# EAGLE design v3 (EAGLE 9.0.1)
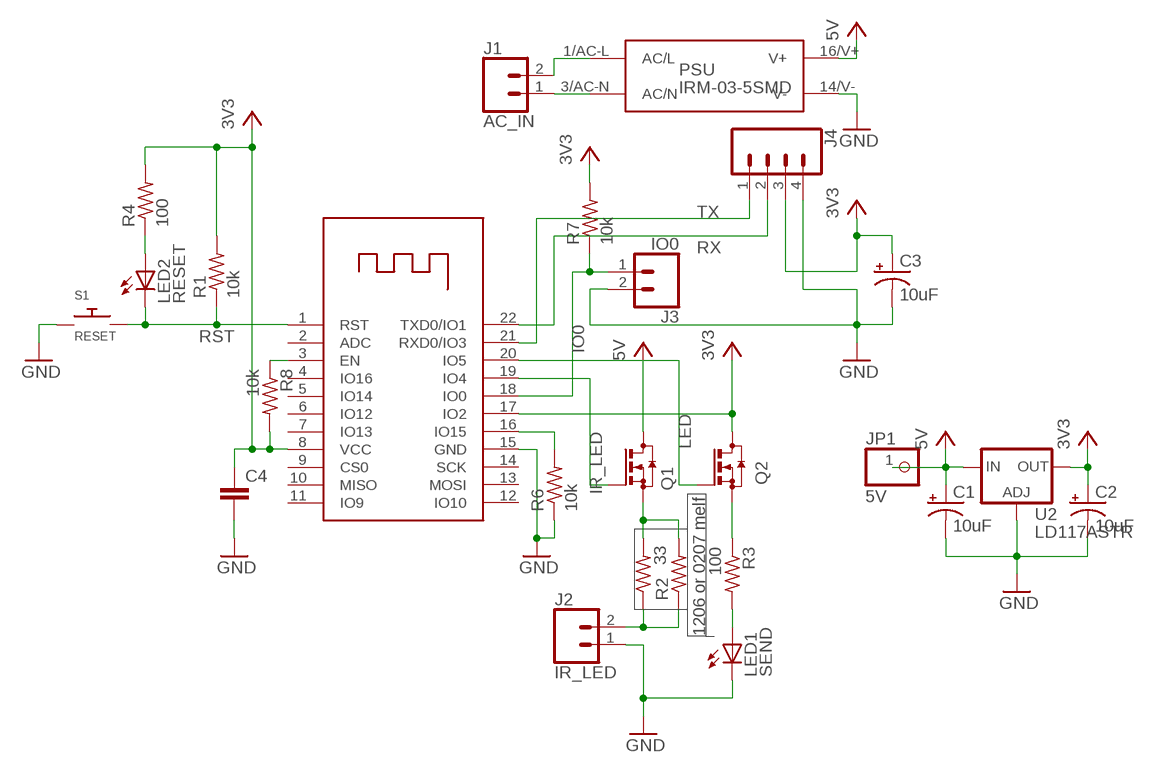
[diagram p0: schematic, sheet 1]

## Parts
C1  10uF  CPOL-US153CLV-0405  [153CLV-0405]
C2  10uF  CPOL-US153CLV-0405  [153CLV-0405]
C3  10uF  CPOL-US153CLV-0405  [153CLV-0405]
C4  C-EUC0805  [C0805]
J1  AC_IN  1X2_5MM_SCREW  [1X2_5MM_SCREW]
J2  IR_LED  1X2_5MM_SCREW  [1X2_5MM_SCREW]
J3  IO0  CONN_02  [1X02]
J4  CONN_04  [1X04]
JP1  5V  PINHD-1X1  [1X01]
LED1  SEND  LEDSML0805  [SML0805]
LED2  RESET  LEDSML0805  [SML0805]
PSU  IRM-03-5SMD  [IRM-03-5S]
Q1  N-MOSFET-SOT23  [SOT23]
Q2  N-MOSFET-SOT23  [SOT23]
R1  10k  R-US_R0603  [R0603]
R2  33  R-US_MELF0207R  [MINI_MELF-0207R]
R3  100  R-US_R0805  [R0805]
R4  100  R-US_R0805  [R0805]
R5  33  R-US_R1206  [R1206]
R6  10k  R-US_R0603  [R0603]
R7  10k  R-US_R0603  [R0603]
R8  10k  R-US_R0603  [R0603]
S1  RESET  BUTTON  [B3F-1000]
U1  ESP-12F  [ESP-12F]
U2  LD117ASTR  [SOT223]

## Nets
3V3: C2.+ C3.+ C4.1 J4.3 Q2.3(D) R1.2 R4.2 R7.2 R8.2 U1.8(VCC) U1.17(IO2) U2.4(OUT)
5V: C1.+ JP1.1 PSU.16/V+(V+) Q1.3(D) U2.3(IN)
AC/L: J1.2 PSU.1/AC-L(AC/L)
AC/N: J1.1 PSU.3/AC-N(AC/N)
EN: R8.1 U1.3(EN)
GND: C1.- C2.- C3.- C4.2 J2.1 J3.2 J4.4 LED1.C PSU.14/V-(V-) R6.1 S1.1 S1.2 U1.15(GND) U2.1(ADJ)
IO0: J3.1 R7.1 U1.18(IO0)
IR_LED: Q1.1(G) U1.19(IO4)
LED: Q2.1(G) U1.20(IO5)
N$1: LED2.A R4.1
N$2: LED1.A R3.2
N$3: R6.2 U1.16(IO15)
N$4: Q2.2(S) R3.1
N$5: Q1.2(S) R2.2 R5.2
N$6: J2.2 R2.1 R5.1
RST: LED2.C R1.1 S1.3 S1.4 U1.1(RST)
RX: J4.2 U1.22(TXD0/IO1)
TX: J4.1 U1.21(RXD0/IO3)
Unconnected: U1.2(ADC) U1.4(IO16) U1.5(IO14) U1.6(IO12) U1.7(IO13) U1.9(CS0) U1.10(MISO) U1.11(IO9) U1.12(IO10) U1.13(MOSI) U1.14(SCK)

## Notes on the sheet
- 1206 or 0207 melf

## Library data of the parts
C1-C3 = resistor:CPOL-US: POLARIZED CAPACITOR, American symbol
C4 = resistor:C-EU: CAPACITOR, European symbol
J1 J2 = my_parts:1X2_5MM_SCREW
J3 = SparkFun-Connectors:CONN_02: Multi connection point. Often used as Generic Header-pin footprint for 0.1 inch spaced/style header connections On any of the 0.1 inch spaced packages, you can populate with these: Break Away Headers - Straight <https://www.sparkfun.com/products/116> (PRT-00116) Break Away Male Headers - Right Angle <https://www.sparkfun.com/products/553> (PRT-00553) Female Headers <https://www.sparkfun.com/products/115> (PRT-00115) Break Away Headers - Machine Pin <https://www.sparkfun.com/products/117> (PRT-00117) Break Away Female Headers - Swiss Machine Pin <https://www.sparkfun.com/products/743> (PRT-00743) For SCREWTERMINALS and SPRING TERMINALS visit here: Screw Terimnals on SparkFun.com <https://www.sparkfun.com/search/results?term=Screw+Terminals> (5mm/3.5mm/2.54mm spacing) This device is also useful as a general connection point to wire up your design to another part of your project. Our various solder wires solder well into these plated through hole pads. Hook-Up Wire - Assortment (Stranded, 22 AWG) <https://www.sparkfun.com/products/11375> (PRT-11375) Hook-Up Wire - Assortment (Solid Core, 22 AWG) <https://www.sparkfun.com/products/11367> (PRT-11367) View the entire wire category on our website here <https://www.sparkfun.com/categories/141> Special notes: Molex polarized connector foot print use with: PRT-08233 with associated crimp pins and housings. 2.54_SCREWTERM for use with PRT-10571. 3.5mm Screw Terminal footprints for PRT-08084 5mm Screw Terminal footprints for use with PRT-08432
J4 = SparkFun-Connectors:CONN_04: Multi connection point. Often used as Generic Header-pin footprint for 0.1 inch spaced/style header connections On any of the 0.1 inch spaced packages, you can populate with these: Break Away Headers - Straight <https://www.sparkfun.com/products/116> (PRT-00116) Break Away Male Headers - Right Angle <https://www.sparkfun.com/products/553> (PRT-00553) Female Headers <https://www.sparkfun.com/products/115> (PRT-00115) Break Away Headers - Machine Pin <https://www.sparkfun.com/products/117> (PRT-00117) Break Away Female Headers - Swiss Machine Pin <https://www.sparkfun.com/products/743> (PRT-00743) For SCREWTERMINALS and SPRING TERMINALS visit here: Screw Terimnals on SparkFun.com <https://www.sparkfun.com/search/results?term=Screw+Terminals> (5mm/3.5mm/2.54mm spacing) This device is also useful as a general connection point to wire up your design to another part of your project. Our various solder wires solder well into these plated through hole pads. Hook-Up Wire - Assortment (Stranded, 22 AWG) <https://www.sparkfun.com/products/11375> (PRT-11375) Hook-Up Wire - Assortment (Solid Core, 22 AWG) <https://www.sparkfun.com/products/11367> (PRT-11367) View the entire wire category on our website here <https://www.sparkfun.com/categories/141> Special notes: Molex polarized connector foot print use with SKU : PRT-08231 with associated crimp pins and housings. 1MM SMD Version SKU: PRT-10208; PROD_ID: CONN-09696
JP1 = adafruit:PINHD-1X1: Pin header 1x1 for 0.1" spacing With round pins
LED1 LED2 = led:LED: LED OSRAM: - CHIPLED LG R971, LG N971, LY N971, LG Q971, LY Q971, LO R971, LY R971 LH N974, LH R974 LS Q976, LO Q976, LY Q976 LO Q996 - Hyper CHIPLED LW Q18S LB Q993, LB Q99A, LB R99A - SideLED LS A670, LO A670, LY A670, LG A670, LP A670 LB A673, LV A673, LT A673, LW A673 LH A674 LY A675 LS A676, LA A676, LO A676, LY A676, LW A676 LS A679, LY A679, LG A679 - Hyper Micro SIDELED® LS Y876, LA Y876, LO Y876, LY Y876 LT Y87S - SmartLED LW L88C, LW L88S LB L89C, LB L89S, LG L890 LS L89K, LO L89K, LY L89K LS L896, LA L896, LO L896, LY L896 - TOPLED LS T670, LO T670, LY T670, LG T670, LP T670 LSG T670, LSP T670, LSY T670, LOP T670, LYG T670 LG T671, LOG T671, LSG T671 LB T673, LV T673, LT T673, LW T673 LH T674 LS T676, LA T676, LO T676, LY T676, LB T676, LH T676, LSB T676, LW T676 LB T67C, LV T67C, LT T67C, LS T67K, LO T67K, LY T67K, LW E67C LS E67B, LA E67B, LO E67B, LY E67B, LB E67C, LV E67C, LT E67C LW T67C LS T679, LY T679, LG T679 LS T770, LO T770, LY T770, LG T770, LP T770 LB T773, LV T773, LT T773, LW T773 LH T774 LS E675, LA E675, LY E675, LS T675 LS T776, LA T776, LO T776, LY T776, LB T776 LHGB T686 LT T68C, LB T68C - Hyper Mini TOPLED® LB M676 - Mini TOPLED Santana® LG M470 LS M47K, LO M47K, LY M47K Source: http://www.osram.convergy.de LUXEON: - LUMILED® LXK2-PW12-R00, LXK2-PW12-S00, LXK2-PW14-U00, LXK2-PW14-V00 LXK2-PM12-R00, LXK2-PM12-S00, LXK2-PM14-U00 LXK2-PE12-Q00, LXK2-PE12-R00, LXK2-PE12-S00, LXK2-PE14-T00, LXK2-PE14-U00 LXK2-PB12-K00, LXK2-PB12-L00, LXK2-PB12-M00, LXK2-PB14-N00, LXK2-PB14-P00, LXK2-PB14-Q00 LXK2-PR12-L00, LXK2-PR12-M00, LXK2-PR14-Q00, LXK2-PR14-R00 LXK2-PD12-Q00, LXK2-PD12-R00, LXK2-PD12-S00 LXK2-PH12-R00, LXK2-PH12-S00 LXK2-PL12-P00, LXK2-PL12-Q00, LXK2-PL12-R00 Source: www.luxeon.com KINGBRIGHT: KA-3528ASYC Source: www.kingbright.com
PSU = my_parts:IRM-03-5
Q1 Q2 = my_parts:N-MOSFET
R1-R8 = resistor:R-US_: RESISTOR, American symbol
S1 = my_parts:BUTTON
U1 = my_parts:ESP-12F
U2 = v-reg:LD117A?*: Low drop fixed and adjustable positive voltage regulators 1 A Source: http://www.st.com/stonline/products/literature/ds/7194/ld1117axx.pdf

## Board
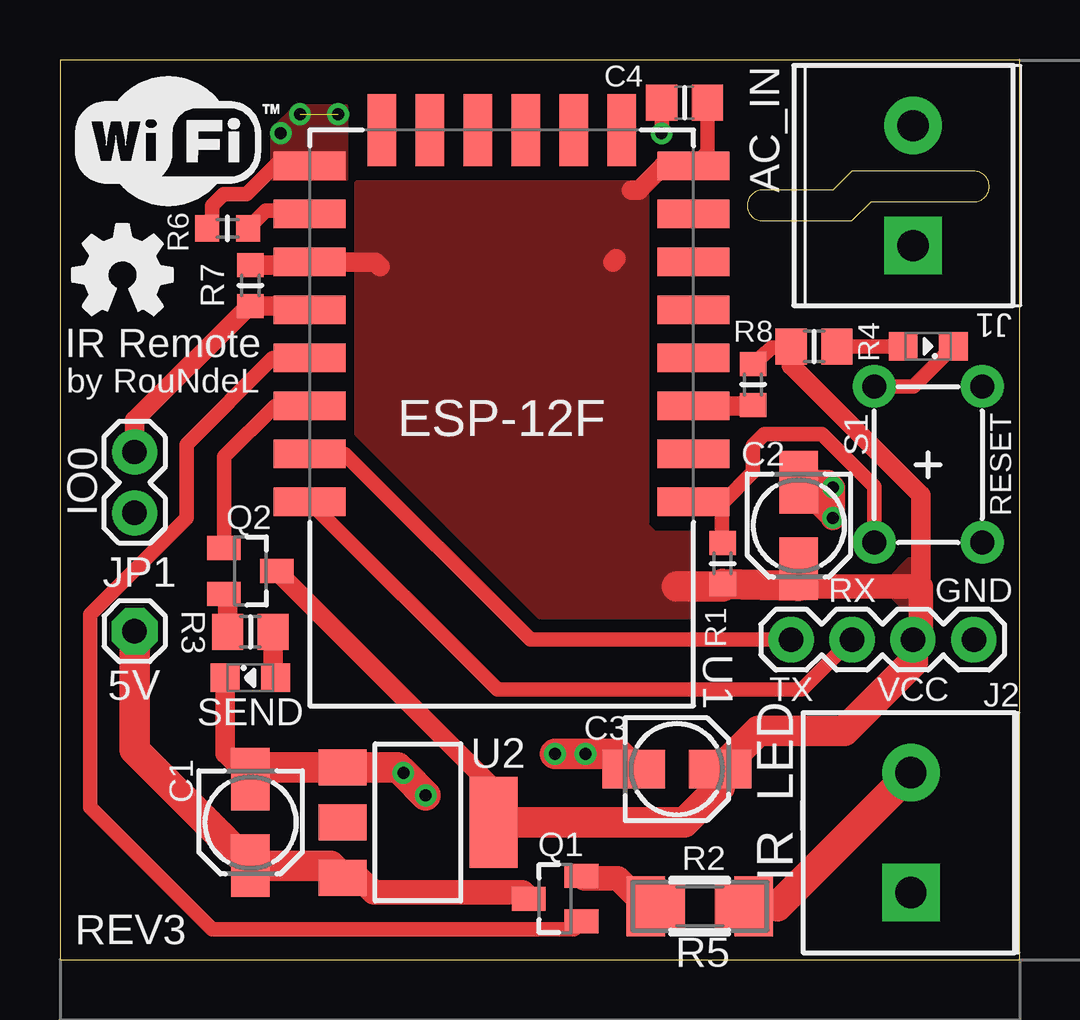
[diagram p1: board, top side]
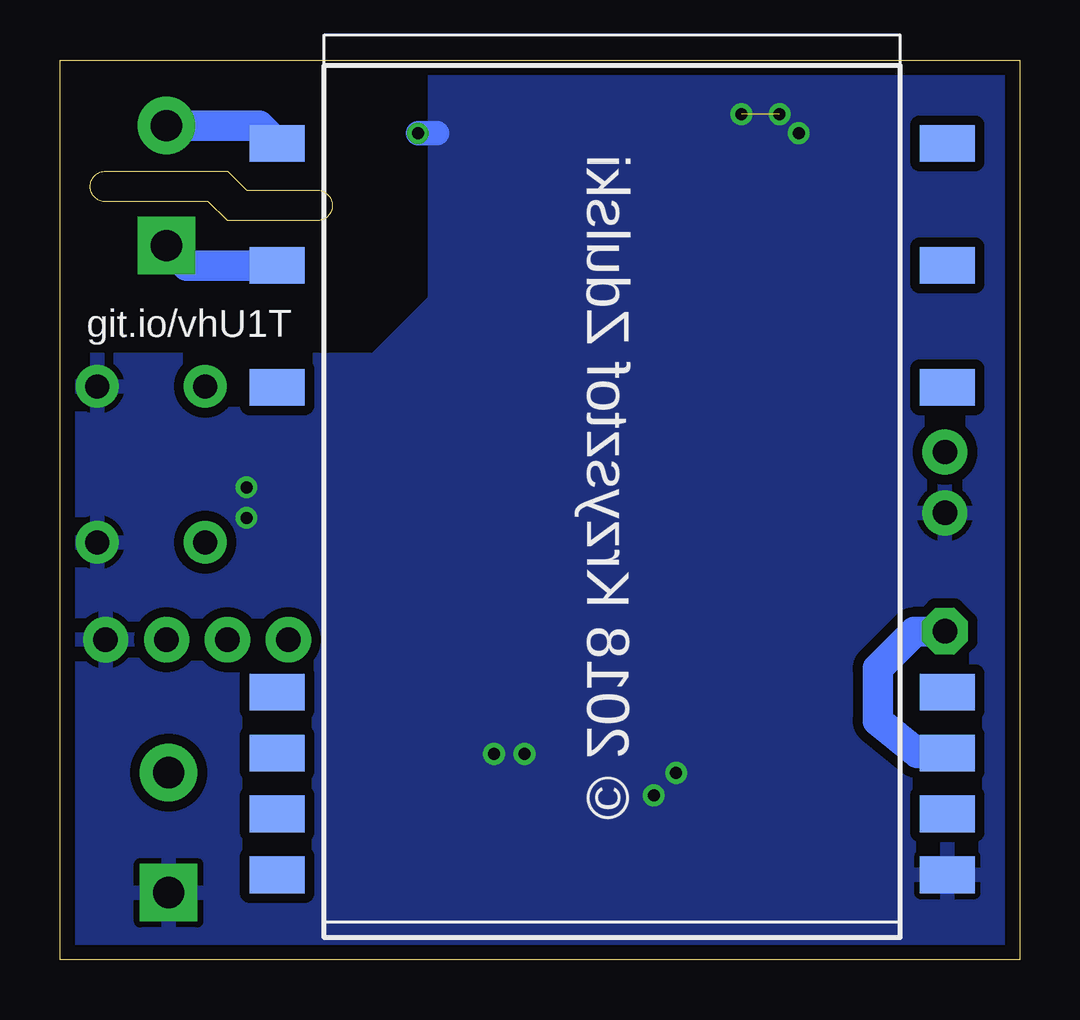
[diagram p2: board, bottom side, seen from below]

Size 40 x 37.5 mm. Coordinates in mm from the lower left corner, seen from the top.
Outline: 0,0 40,0 40,37.5 0,37.5 0,0
Outline: 38.1,32.86 33.02,32.86 32.23,32.07 29.37,32.07 arc194 29.37,30.8 33.02,30.8 33.81,31.59 38.1,31.59 arc181 38.1,32.86
Copper layers (1*16): Top 0.035mm / dielectric 1.5mm / Bottom 0.035mm
Design rules "default *": minimum track width 16mil, minimum drill 0.35mm, track to track 12mil, track to pad 12mil, pad to pad 12mil, via to via 12mil, smd to smd 6mil, copper to edge 24mil, drill to drill 0.6mm, minimum pad ring 10mil, minimum via ring 8mil, stop-mask expansion 4mil, vias tented up to drill 0.5mm, thermal gap 10mil

### Footprints (pad centres in the part's own frame; a part is rotated, then mirrored left to right if it is on the bottom)
153CLV-0405 = smd 2.6 x 1.6: + 1.8,0; - -1.8,0
C0805 = smd 1.3 x 1.5: 1 -0.95,0; 2 0.95,0
1X2_5MM_SCREW = drill 1.3 pad 2.4 square: 1 2.5,0 | drill 1.3 pad 2.4: 2 -2.5,0
1X02 = drill 1.016 pad 1.88: 1 0,0; 2 2.54,0
1X04 = drill 1.016 pad 1.88: 1 0,0; 2 2.54,0; 3 5.08,0; 4 7.62,0
1X01 = drill 1.016 pad 1.93 octagon: 1 0,0
SML0805 = smd 1.2 x 1.2: A 1.05,0; C -1.05,0
IRM-03-5S = smd 1.524 x 2.286: 1/AC-L -13.97,-13.97; 3/AC-N -8.89,-13.97; 5 -3.81,-13.97; 10 8.89,-13.97; 11 11.43,-13.97; 12 13.97,-13.97; 13 16.51,-13.97; 14/V- 16.51,13.97; 15 13.97,13.97; 16/V+ 11.43,13.97; 17 8.89,13.97; 22 -3.81,13.97; 24 -8.89,13.97; 26 -13.97,13.97
SOT23 = smd 1 x 1.4: 1 -0.95,-1.1; 2 0.95,-1.1; 3 0,1.1
R0603 = smd 1 x 1.1: 1 -0.85,0; 2 0.85,0
MINI_MELF-0207R = smd 1.6 x 2.5: 1 -2.25,0; 2 2.25,0
R0805 = smd 1.3 x 1.5: 1 -0.95,0; 2 0.95,0
R1206 = smd 1.6 x 1.803: 1 -1.422,0; 2 1.422,0
B3F-1000 = drill 1 pad 1.778: 1 -3.25,2.25; 2 3.25,2.25; 3 -3.25,-2.25; 4 3.25,-2.25
ESP-12F = smd 3 x 1.2: 1 -8,3.5; 2 -8,1.5; 3 -8,-0.5; 4 -8,-2.5; 5 -8,-4.5; 6 -8,-6.5; 7 -8,-8.5; 8 -8,-10.5; 15 8,-10.5; 16 8,-8.5; 17 8,-6.5; 18 8,-4.5; 19 8,-2.5; 20 8,-0.5; 21 8,1.5; 22 8,3.5 | smd 1.2 x 3: 9 -5,-12; 10 -3,-12; 11 -1,-12; 12 1,-12; 13 3,-12; 14 5,-12
SOT223 = smd 1.5 x 2: 1 -2.3,-3.15; 2 0,-3.15; 3 2.3,-3.15 | smd 3.8 x 2: 4 0,3.15

### Placement (x,y rotation side)
C1  7.94,5.71 270 top
C2  30.8,18.1 270 top
C3  25.72,7.94 0 top
C4  26.04,35.72 180 top
J1  35.56,32.27 270 top
J2  35.47,5.29 270 top
J3  3.11,21.16 270 top
J4  30.48,13.34 0 top
JP1  3.11,13.69 0 top
LED1  7.94,11.75 0 top
LED2  36.2,25.56 180 top
PSU  16.98,20.04 270 bottom
Q1  20.64,2.54 90 top
Q2  7.94,16.2 270 top
R1  27.62,16.52 270 top
R2  26.67,2.22 180 top
R3  7.94,13.66 0 top
R4  31.43,25.56 180 top
R5  26.67,2.22 180 top
R6  6.99,30.48 0 top
R7  7.94,28.1 90 top
R8  28.89,23.97 90 top
S1  36.2,20.64 270 top
U1  18.41,22.58 180 top
U2  14.92,5.71 270 top

### Tracks (layer width: path | path; a pad name or v marks a point on that pad's centre or on a via)
3V3
  Top 0.61: R4.2 30.17,25.51 29.68,25.52 R8.2 | U1.8 26.98,33.65 C4.1
  Top 0.813: Q2.3 18.07,7.16 U2.4 | U1.8 25.14,33.08 24.13,32.07 23.81,32.07 | 23.05,29.08 23.18,29.21 | 13.34,28.89 13.14,29.08 U1.17 10.28,28.95 R7.2 | 35.88,15.56 35.88,19.37 30.49,24.76 R4.2
  Top 1.016: R1.2 27.61,15.56 | J4.3 35.88,13.65 35.88,15.56 30.8,15.56 | 30.79,15.57 30.8,15.56 | C2.+ 30.8,15.56
  Top 1.27: J4.3 35.56,12.38 32.7,9.53 29.11,9.53 C3.+ 27.52,7.2 26.04,5.71 U2.4 | 27.61,15.56 25.72,15.56 | R1.2 30.79,15.57
  pour Top: 12.38,32.38 24.45,32.38 24.45,18.1 24.77,17.78 26.35,17.78 26.35,14.29 20,14.29 12.38,21.91
  pour Top: 34.61,15.88 35.4,16.67 36.04,16.67 36.04,14.45 35.4,14.45 34.61,15.24
5V
  Top 1.016: Q1.3 19.28,2.8 13.07,2.8 12.45,3.42 U2.3
  Top 1.27: JP1.1 3.11,8.75 C1.+ 11.27,3.92 U2.3
  Bottom 1.27: JP1.1 4.39,13.65 5.91,12.13 5.91,9.96 4.26,8.61 PSU.16/V+
AC/L
  Bottom 1.27: PSU.1/AC-L 31.71,34.77 J1.2
AC/N
  Bottom 1.27: PSU.3/AC-N 34.73,28.93 J1.1
EN
  Top 0.813: 26.51,23.18 U1.3 28.85,23.08 R8.1
GND  (via drill 0.5, 0.5 pad 0.64)  (1 unrouted)
  Top 0.61: C4.2 v25.09,34.44 v25.08,34.44 | R6.1 6.35,30.7 6.35,31.43 6.83,31.91 7.78,31.91 9.05,33.18 9.99,33.18 10.25,32.92
  Top 0.813: LED1.C 6.89,8.57 C1.- | 10.25,32.92 U1.15
  Top 1.016: C2.- 32.01,19.9 v32.23,19.68 v32.23,18.41 32.23,18.47 C2.-
  Top 1.27: C1.- 8.44,8.02 U2.1 14.08,8.02 v14.31,7.78 v15.25,6.84 | C3.- 23.28,8.57 v21.91,8.57 v20.64,8.57
  Bottom 0.61: v25.08,34.44 v25.07,34.45
  Bottom 1.016: v25.07,34.45 24.29,34.45
  other vias: 9.21,34.45 10,35.24 11.59,35.24
  pour Bottom (isolate 0.406): 0,0 40,0 40,25 26.86,25 24.36,27.5 24.36,37.5 0,37.5
  pour Top (no thermals): 8.89,32.54 8.89,34.61 9.84,35.56 11.91,35.56 11.91,32.54
IO0
  Top 0.813: J3.1 3.11,22.48 7.88,27.25 R7.1 10.25,27.25 U1.18
IR_LED
  Top 0.61: U1.19 8.86,25.08 5.29,21.47 5.29,18.4 1.27,14.38 1.27,6.35 6.35,1.27 21.42,1.27 Q1.1
LED
  Top 0.61: Q2.1 6.84,20.96 8.96,23.08 U1.20
N$1
  Top 0.61: R4.1 LED2.A
N$2
  Top 0.406: LED1.A 8.89,11.85
  Top 0.813: 8.89,11.85 R3.2
N$3
  Top 0.61: R6.2 8.57,31.22 10.28,31.22
  Top 0.813: 10.28,31.22 U1.16
N$4
  Top 0.406: Q2.2 6.99,15.1
  Top 0.813: 6.99,15.1 R3.1
N$5
  Top 0.203: R5.2 R2.2
  Top 0.406: 21.85,3.38 Q1.2
  Top 1.016: R2.2 23.27,3.38 21.85,3.38
N$6
  Top 0.203: 29.9,2.22 R2.1 R5.1
  Top 1.27: 29.9,2.22 J2.2
RST
  Top 0.61: R1.1 27.59,17.5 27.59,19.08 U1.1 27.66,19.08 28.89,20.32 28.89,21.43 29.37,21.91 31.76,21.91 33.95,19.72 S1.4 | S1.3 35.58,23.89 LED2.C
RX
  Top 0.61: U1.22 18.25,11.25 30.94,11.25 J4.2
TX
  Top 0.61: J4.1 19.62,13.34 11.87,21.08 U1.21

### Text on the board
_tplace: IR Remote | by RouNdeL | RX | GND | TX | VCC | REV3
_bplace: git.io/vhU1T | © 2018 Krzysztof Zdulski